# EAGLE schematic LionDrillCharger (EAGLE 6.5.0)
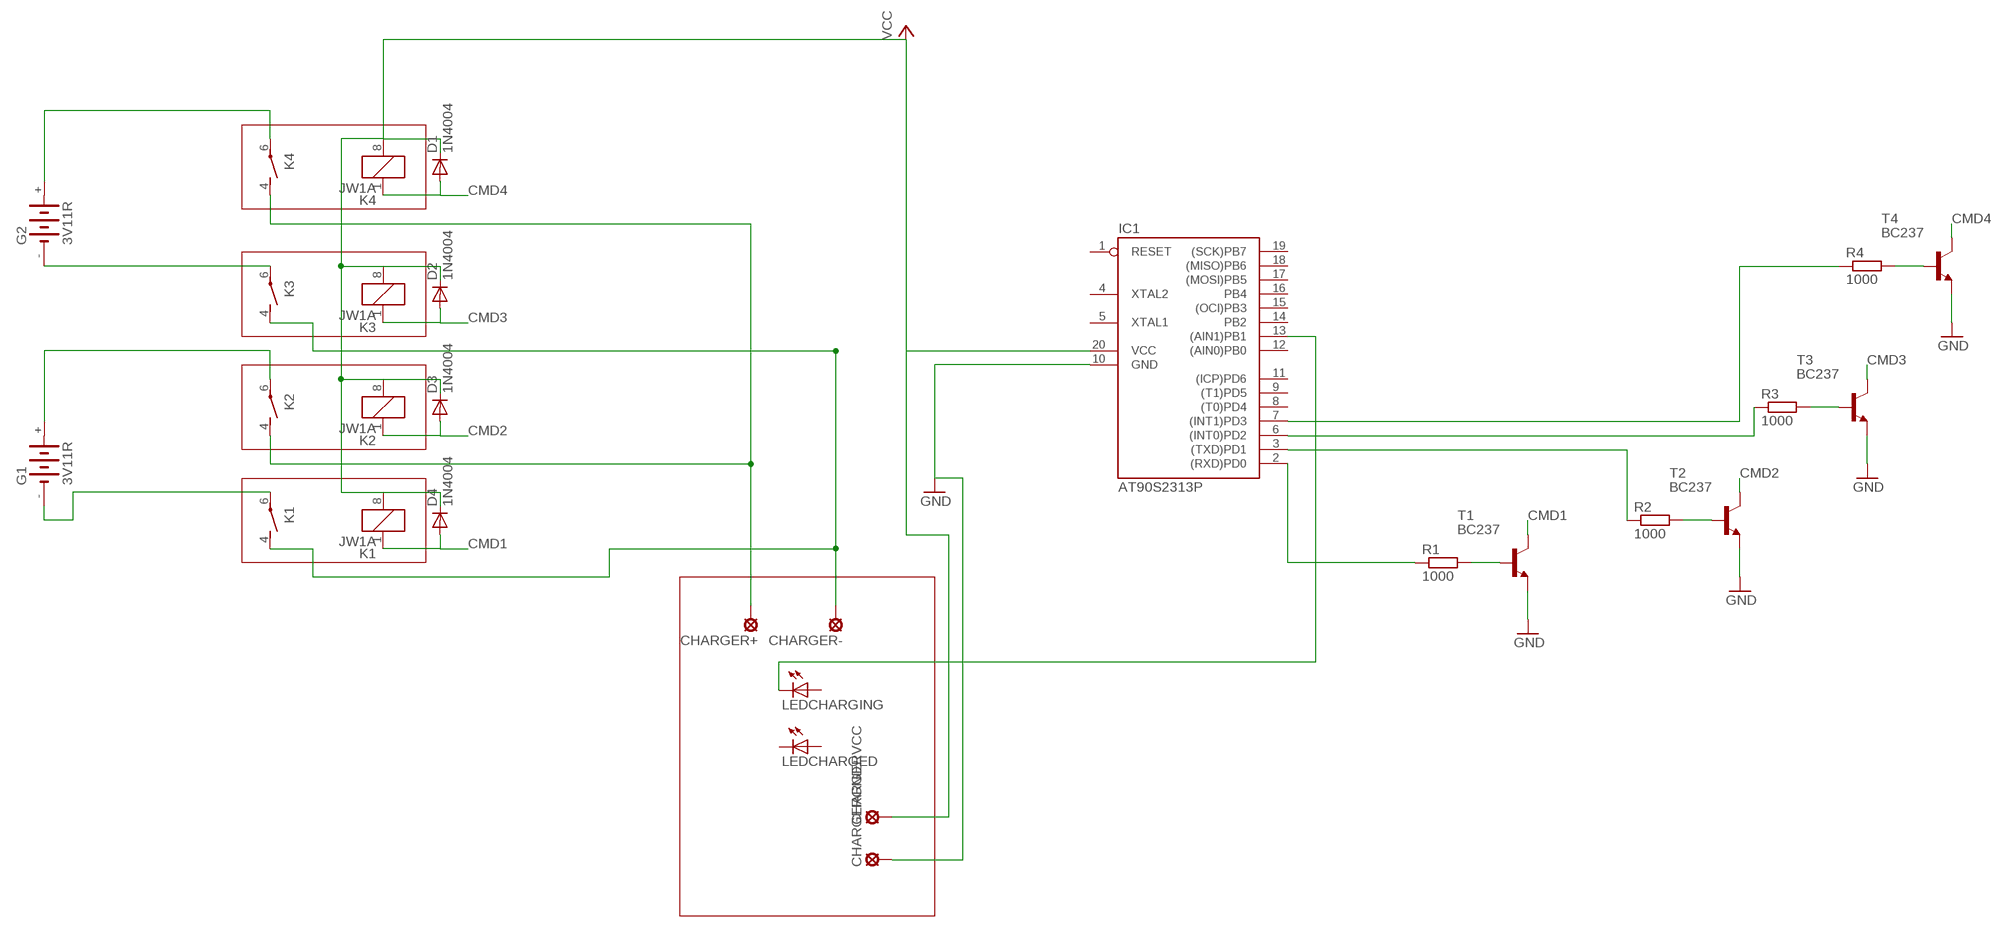
[diagram p0: schematic, sheet 1]

## Parts
CHARGER+  LSP11  [LSP11]
CHARGER-  LSP11  [LSP11]
CHARGERGND  LSP11  [LSP11]
CHARGERVCC  LSP11  [LSP11]
D1  1N4004  [DO41-10]
D2  1N4004  [DO41-10]
D3  1N4004  [DO41-10]
D4  1N4004  [DO41-10]
G1  3V11R  [3V11R]
G2  3V11R  [3V11R]
IC1  AT90S2313P  [DIL20]
K1  JW1A  [JW1A]
K2  JW1A  [JW1A]
K3  JW1A  [JW1A]
K4  JW1A  [JW1A]
LEDCHARGED  LED3MM  [LED3MM]
LEDCHARGING  LED3MM  [LED3MM]
R1  1000  R-EU_0204/5  [0204/5]
R2  1000  R-EU_0204/5  [0204/5]
R3  1000  R-EU_0204/5  [0204/5]
R4  1000  R-EU_0204/5  [0204/5]
T1  BC237  [TO92]
T2  BC237  [TO92]
T3  BC237  [TO92]
T4  BC237  [TO92]

## Nets
CMD1: D4.A K1.1 T1.3(C)
CMD2: D3.A K2.1 T2.3(C)
CMD3: D2.A K3.1 T3.3(C)
CMD4: D1.A K4.1 T4.3(C)
GND: CHARGERGND.MP IC1.10(GND) T1.1(E) T2.1(E) T3.1(E) T4.1(E)
N$1: CHARGER+.MP K2.4(1:S) K4.4(1:S)
N$2: R1.2 T1.2(B)
N$3: G2.+ K4.6(1:P)
N$4: G1.+ K2.6(1:P)
N$5: G1.- K1.6(1:P)
N$6: G2.- K3.6(1:P)
N$7: CHARGER-.MP K1.4(1:S) K3.4(1:S)
N$8: R2.2 T2.2(B)
N$9: R3.2 T3.2(B)
N$10: R4.2 T4.2(B)
N$11: IC1.2((RXD)PD0) R1.1
N$12: IC1.3((TXD)PD1) R2.1
N$13: IC1.6((INT0)PD2) R3.1
N$14: IC1.7((INT1)PD3) R4.1
N$15: IC1.13((AIN1)PB1) LEDCHARGING.K(C)
VCC: CHARGERVCC.MP D1.C D2.C D3.C D4.C IC1.20(VCC) K1.8 K2.8 K3.8 K4.8
Unconnected: IC1.1(RESET) IC1.4(XTAL2) IC1.5(XTAL1) IC1.8((T0)PD4) IC1.9((T1)PD5) IC1.11((ICP)PD6) IC1.12((AIN0)PB0) IC1.14(PB2) IC1.15((OCI)PB3) IC1.16(PB4) IC1.17((MOSI)PB5) IC1.18((MISO)PB6) IC1.19((SCK)PB7) LEDCHARGED.A LEDCHARGED.K(C) LEDCHARGING.A

## Library data of the parts
CHARGER+ CHARGER- CHARGERGND CHARGERVCC = solpad:LSP11: SOLDER PAD drill 1.1 mm
D1-D4 = diode:1N4004: DIODE general purpose rectifier, 1 A
G1 G2 = battery:3V11R: NC ACCU Varta
IC1 = atmel:AT90S2313: MICROCONTROLLER 2 Kbytes FLASH 128 bytes SRAM 128 bytes EEPROM UART; OC_FARNELL: unknown; OC_NEWARK: unknown
K1-K4 = relay:JW1A: Power relay Source: Panasonic Electric Works Co., Ltd. / jw.catalog.pdf
LEDCHARGED LEDCHARGING = led:LED: LED OSRAM: - CHIPLED LG R971, LG N971, LY N971, LG Q971, LY Q971, LO R971, LY R971 LH N974, LH R974 LS Q976, LO Q976, LY Q976 LO Q996 - Hyper CHIPLED LW Q18S LB Q993, LB Q99A, LB R99A - SideLED LS A670, LO A670, LY A670, LG A670, LP A670 LB A673, LV A673, LT A673, LW A673 LH A674 LY A675 LS A676, LA A676, LO A676, LY A676, LW A676 LS A679, LY A679, LG A679 - Hyper Micro SIDELED® LS Y876, LA Y876, LO Y876, LY Y876 LT Y87S - SmartLED LW L88C, LW L88S LB L89C, LB L89S, LG L890 LS L89K, LO L89K, LY L89K LS L896, LA L896, LO L896, LY L896 - TOPLED LS T670, LO T670, LY T670, LG T670, LP T670 LSG T670, LSP T670, LSY T670, LOP T670, LYG T670 LG T671, LOG T671, LSG T671 LB T673, LV T673, LT T673, LW T673 LH T674 LS T676, LA T676, LO T676, LY T676, LB T676, LH T676, LSB T676, LW T676 LB T67C, LV T67C, LT T67C, LS T67K, LO T67K, LY T67K, LW E67C LS E67B, LA E67B, LO E67B, LY E67B, LB E67C, LV E67C, LT E67C LW T67C LS T679, LY T679, LG T679 LS T770, LO T770, LY T770, LG T770, LP T770 LB T773, LV T773, LT T773, LW T773 LH T774 LS E675, LA E675, LY E675, LS T675 LS T776, LA T776, LO T776, LY T776, LB T776 LHGB T686 LT T68C, LB T68C - Hyper Mini TOPLED® LB M676 - Mini TOPLED Santana® LG M470 LS M47K, LO M47K, LY M47K Source: http://www.osram.convergy.de LUXEON: - LUMILED® LXK2-PW12-R00, LXK2-PW12-S00, LXK2-PW14-U00, LXK2-PW14-V00 LXK2-PM12-R00, LXK2-PM12-S00, LXK2-PM14-U00 LXK2-PE12-Q00, LXK2-PE12-R00, LXK2-PE12-S00, LXK2-PE14-T00, LXK2-PE14-U00 LXK2-PB12-K00, LXK2-PB12-L00, LXK2-PB12-M00, LXK2-PB14-N00, LXK2-PB14-P00, LXK2-PB14-Q00 LXK2-PR12-L00, LXK2-PR12-M00, LXK2-PR14-Q00, LXK2-PR14-R00 LXK2-PD12-Q00, LXK2-PD12-R00, LXK2-PD12-S00 LXK2-PH12-R00, LXK2-PH12-S00 LXK2-PL12-P00, LXK2-PL12-Q00, LXK2-PL12-R00 Source: www.luxeon.com KINGBRIGHT: KA-3528ASYC Source: www.kingbright.com
R1-R4 = resistor:R-EU_: RESISTOR, European symbol
T1-T4 = transistor:BC237: NPN TRANSISTOR